# EasyEDA Pro project pcb.eprj, schematic SCHEME

## Sheets
1 KEYPAD: Board Name: BOARD; Create Date: 2025-03-02; Page Name: KEYPAD; Project Name: pcb; Schematic Name: SCHEME; Update Date: 2025-05-31; Company: EasyEDA.com; Page Size: A4; Version: V1.0
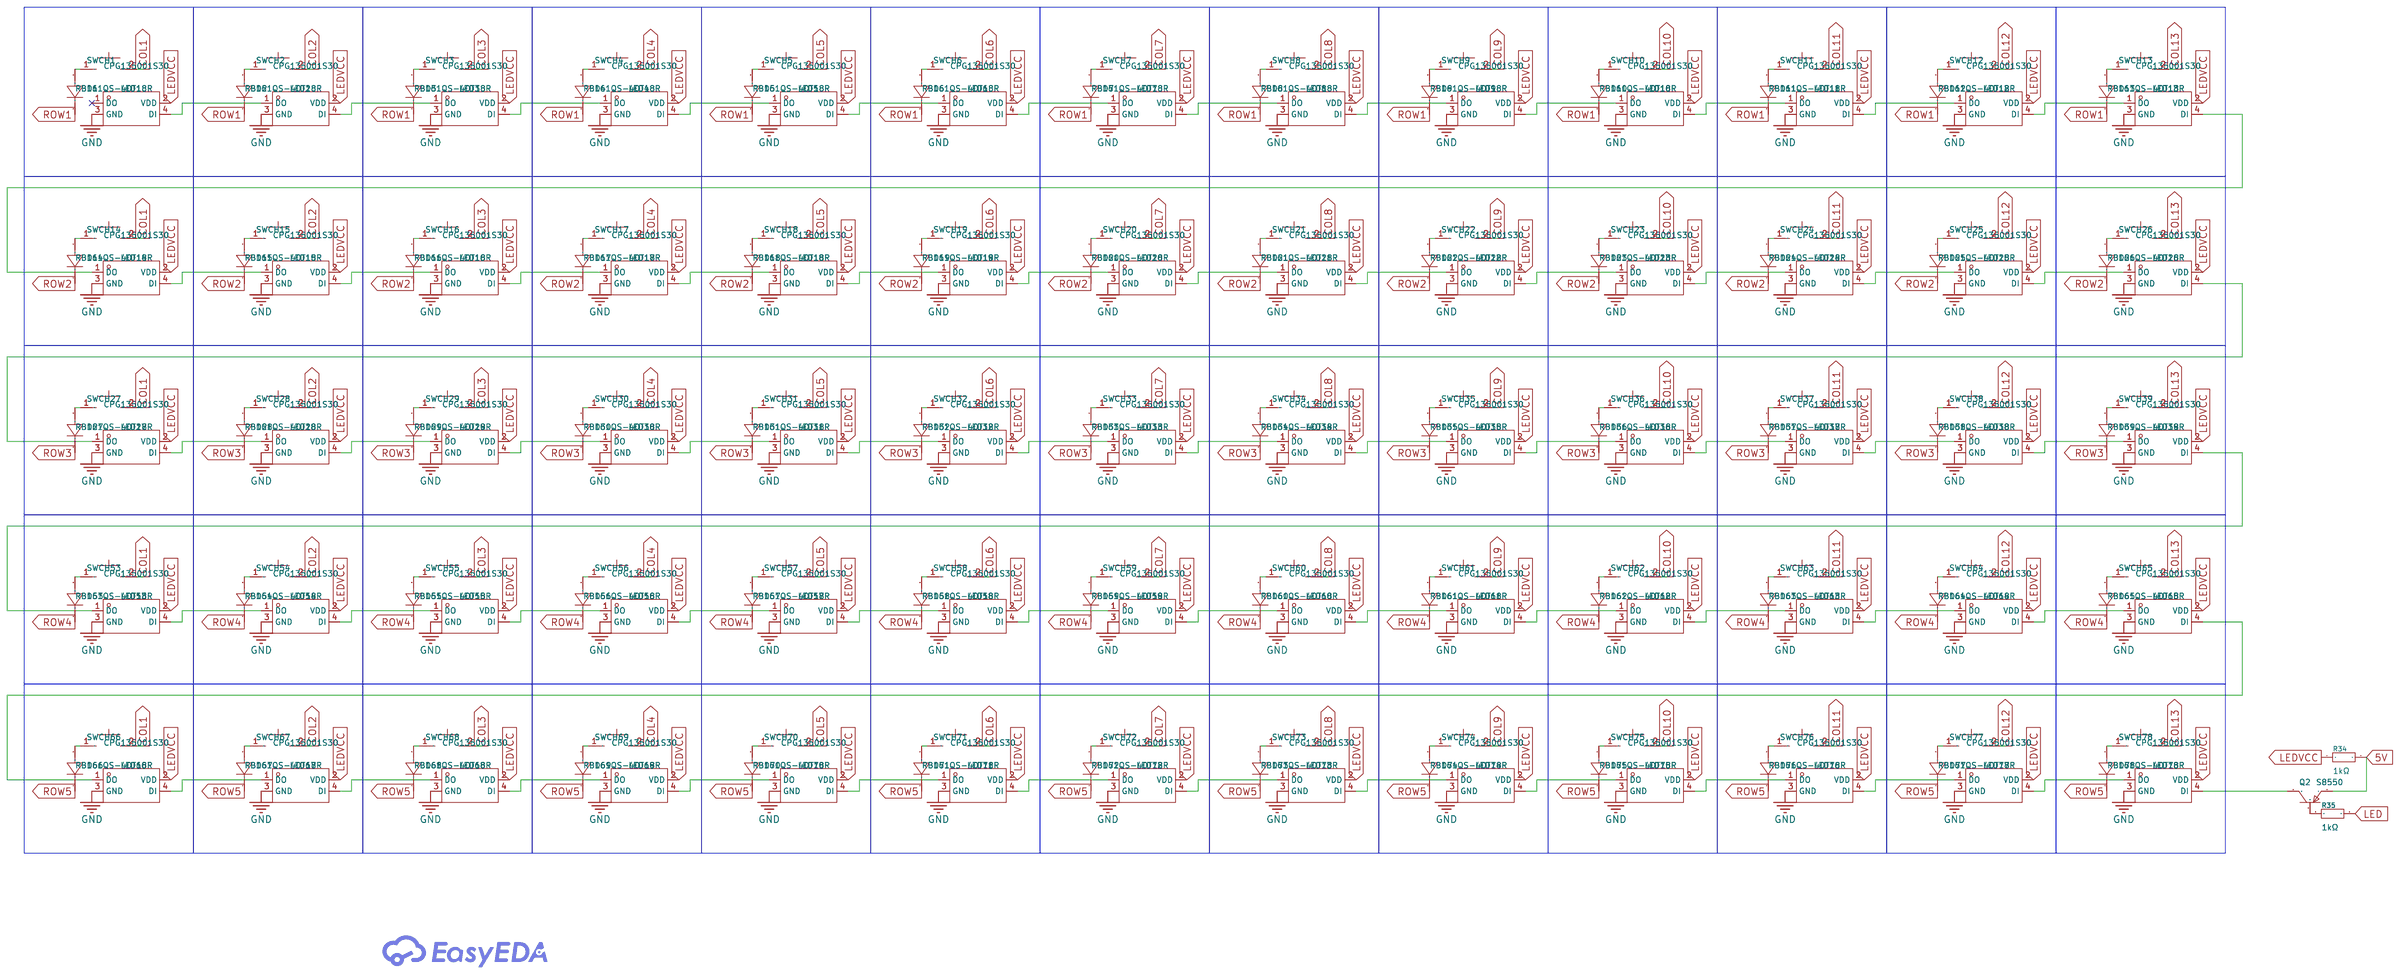
[diagram p0: KEYPAD]
2 MCU: Page Name: MCU; Update Date: 2025-06-02
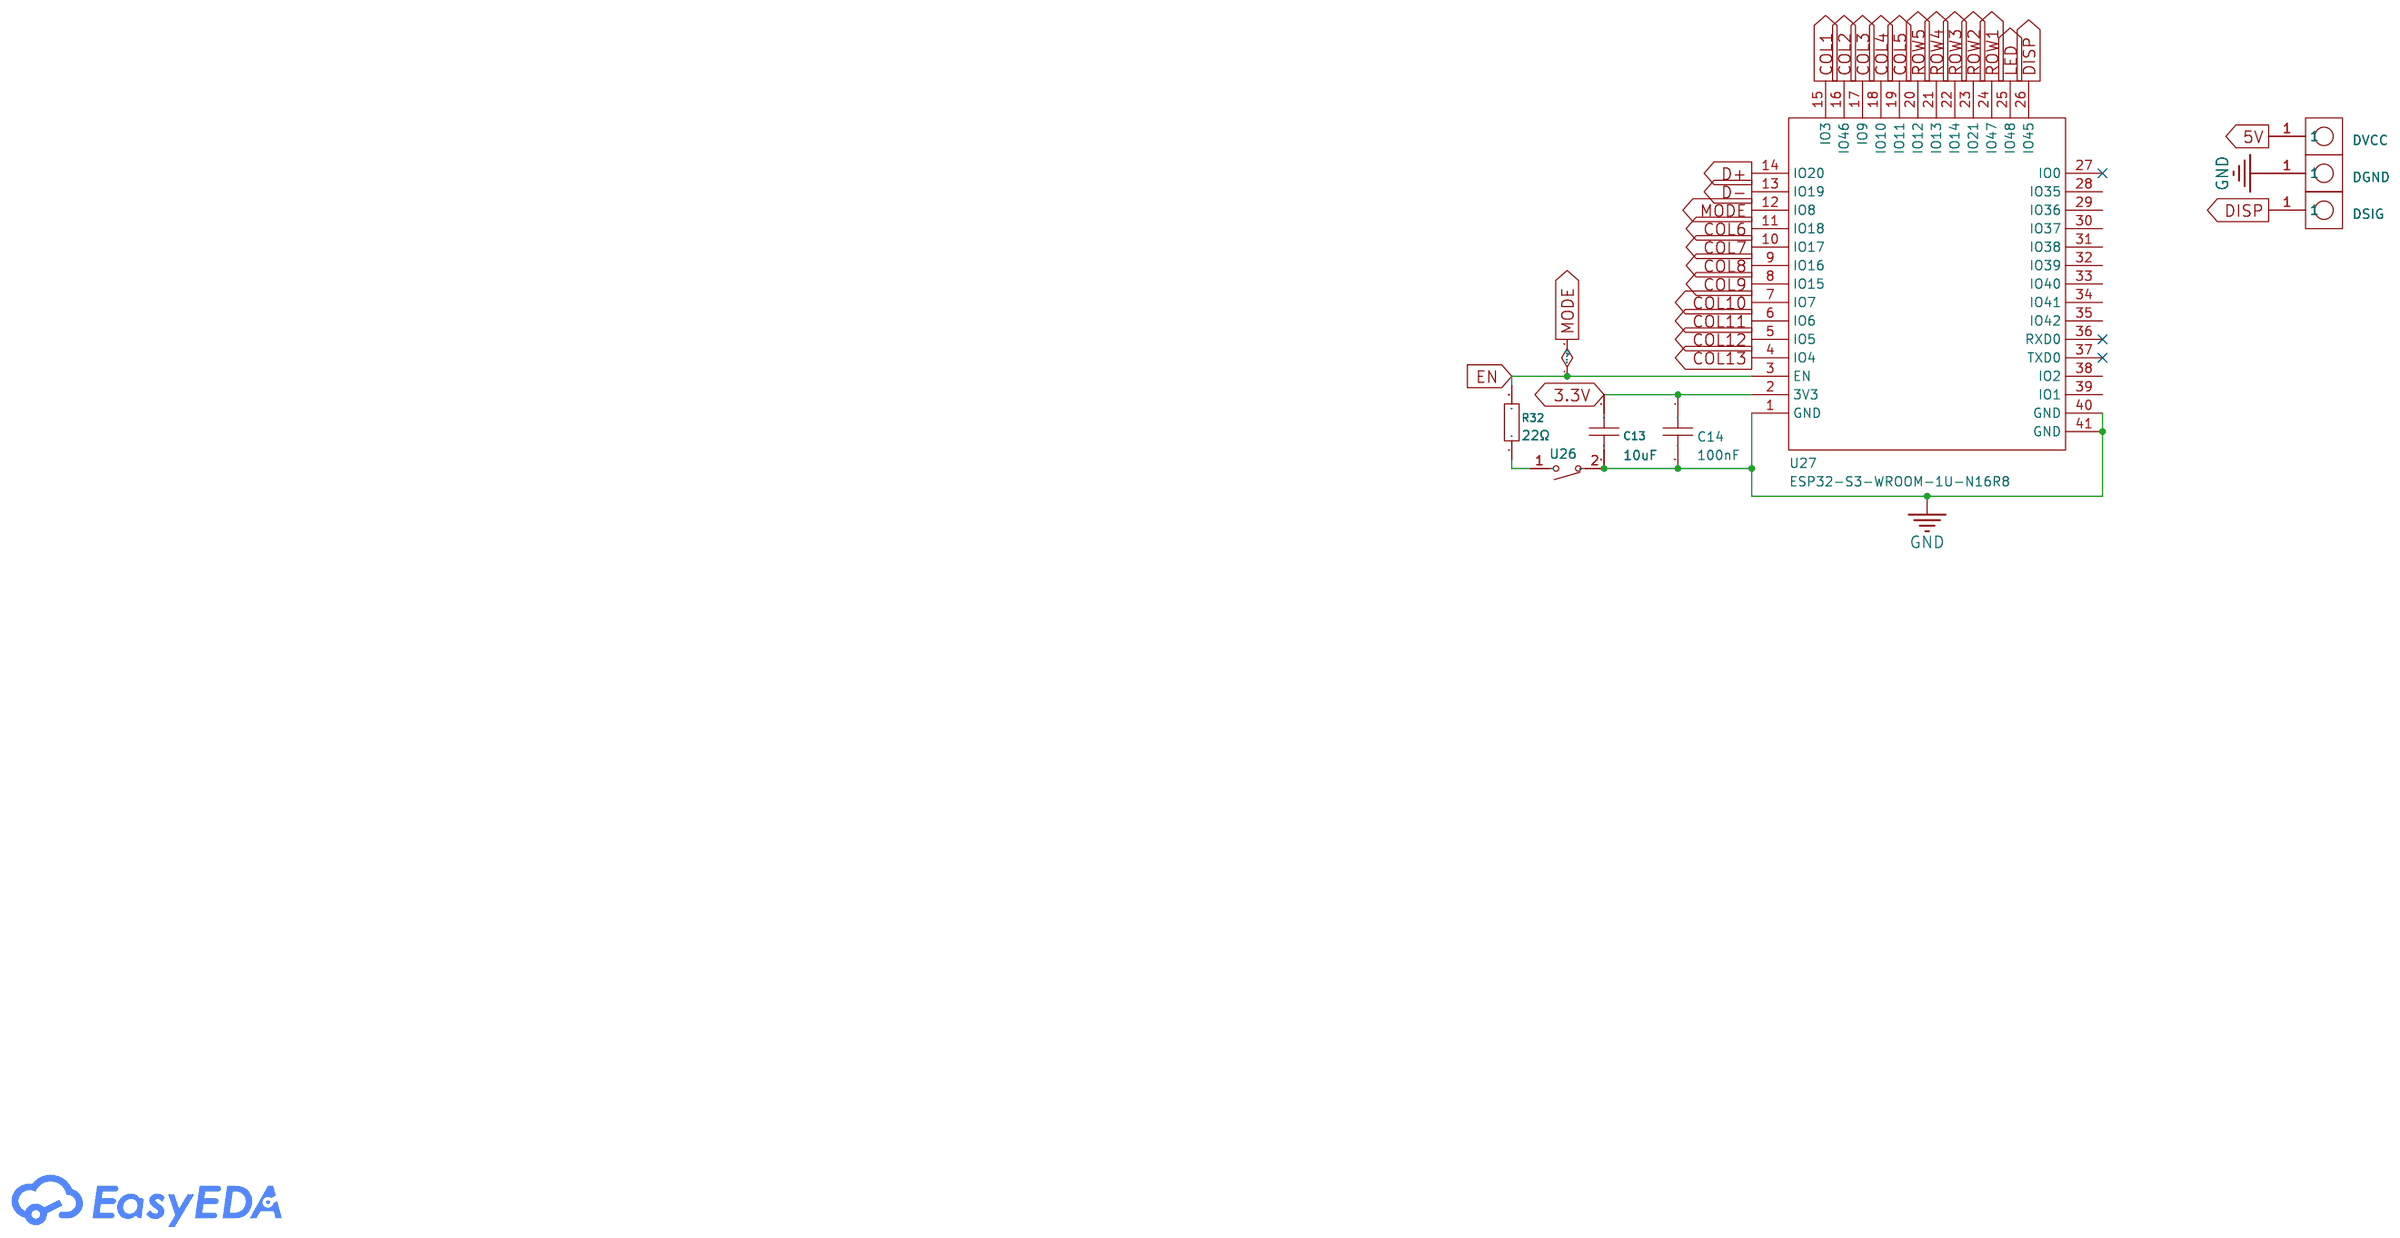
[diagram p1: MCU]
3 POWER: Create Date: 2025-03-04; Page Name: POWER; Update Date: 2025-03-05
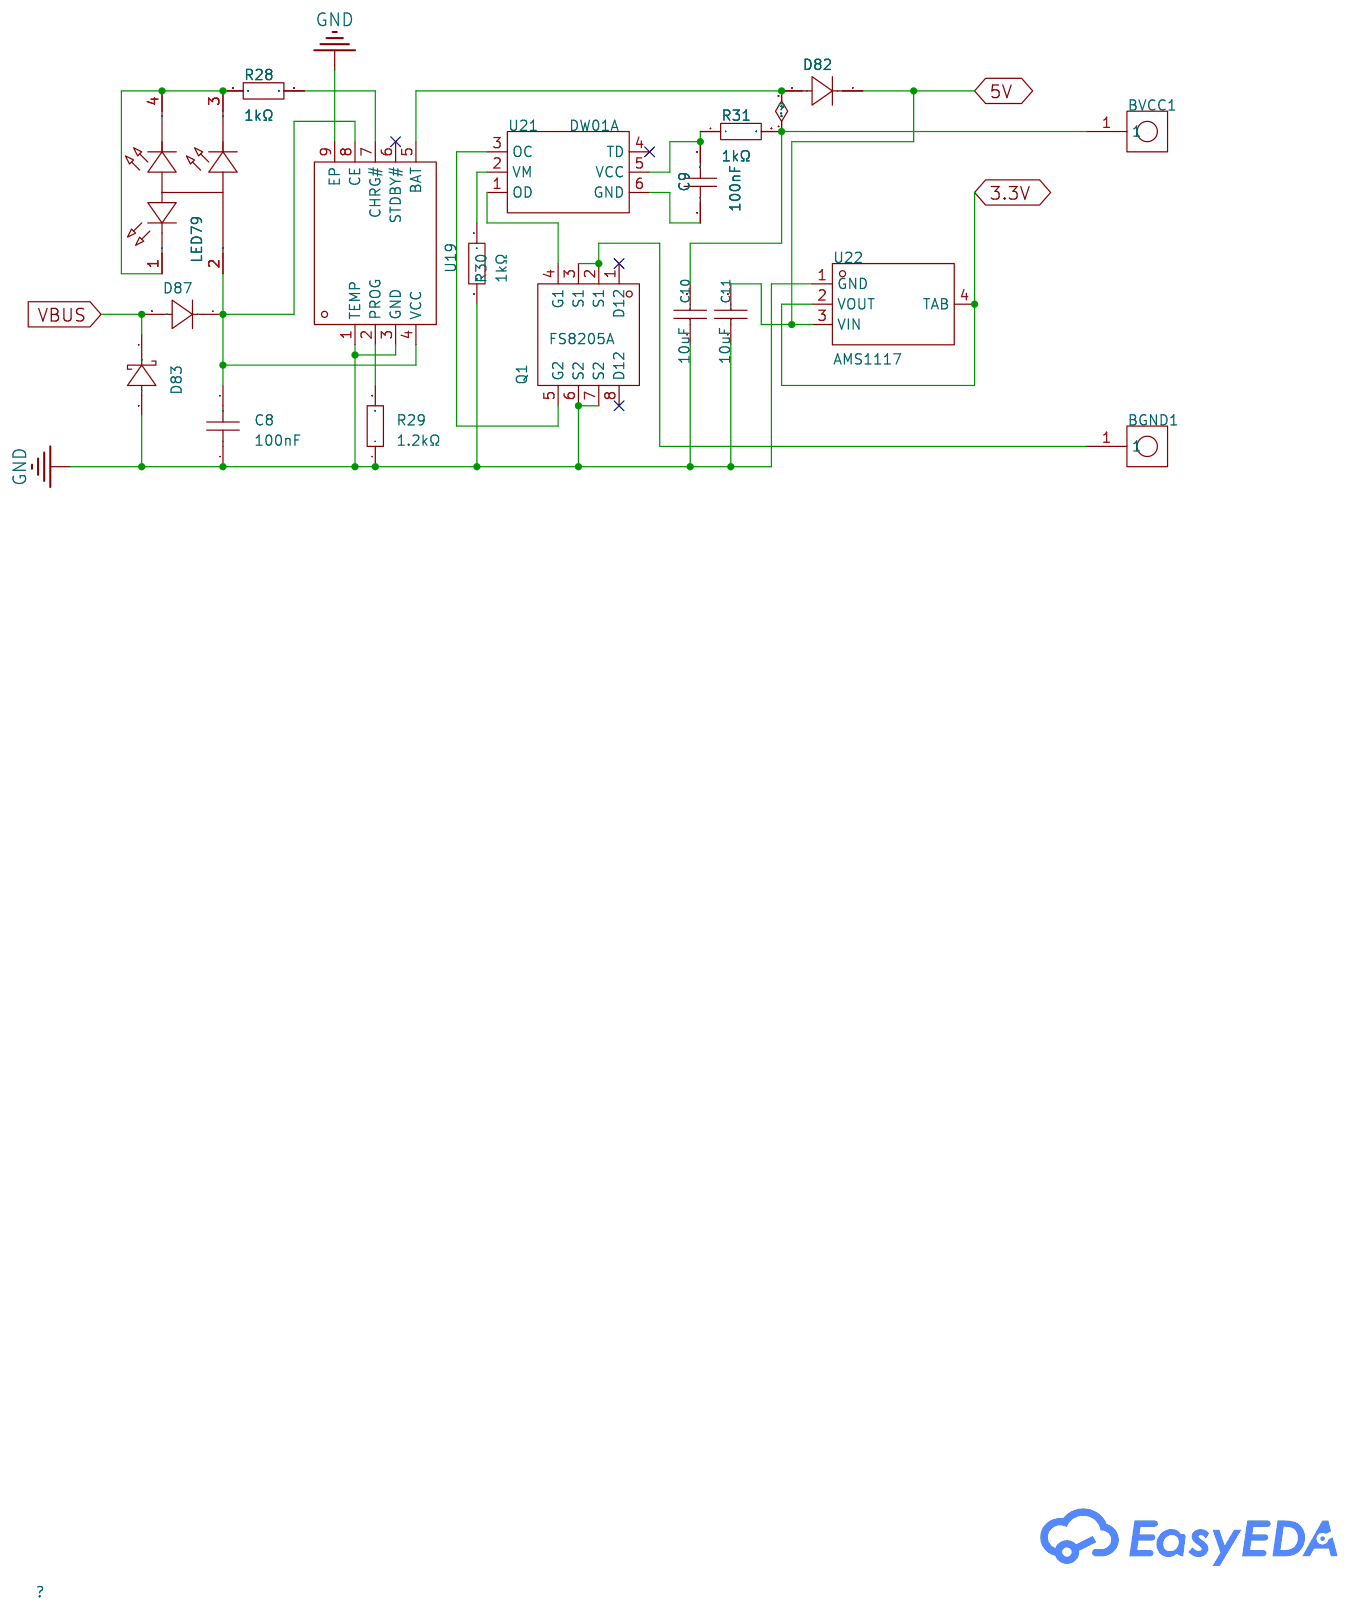
[diagram p2: POWER]
4 MODE: Create Date: 2025-03-04; Page Name: MODE; Update Date: 2025-03-06
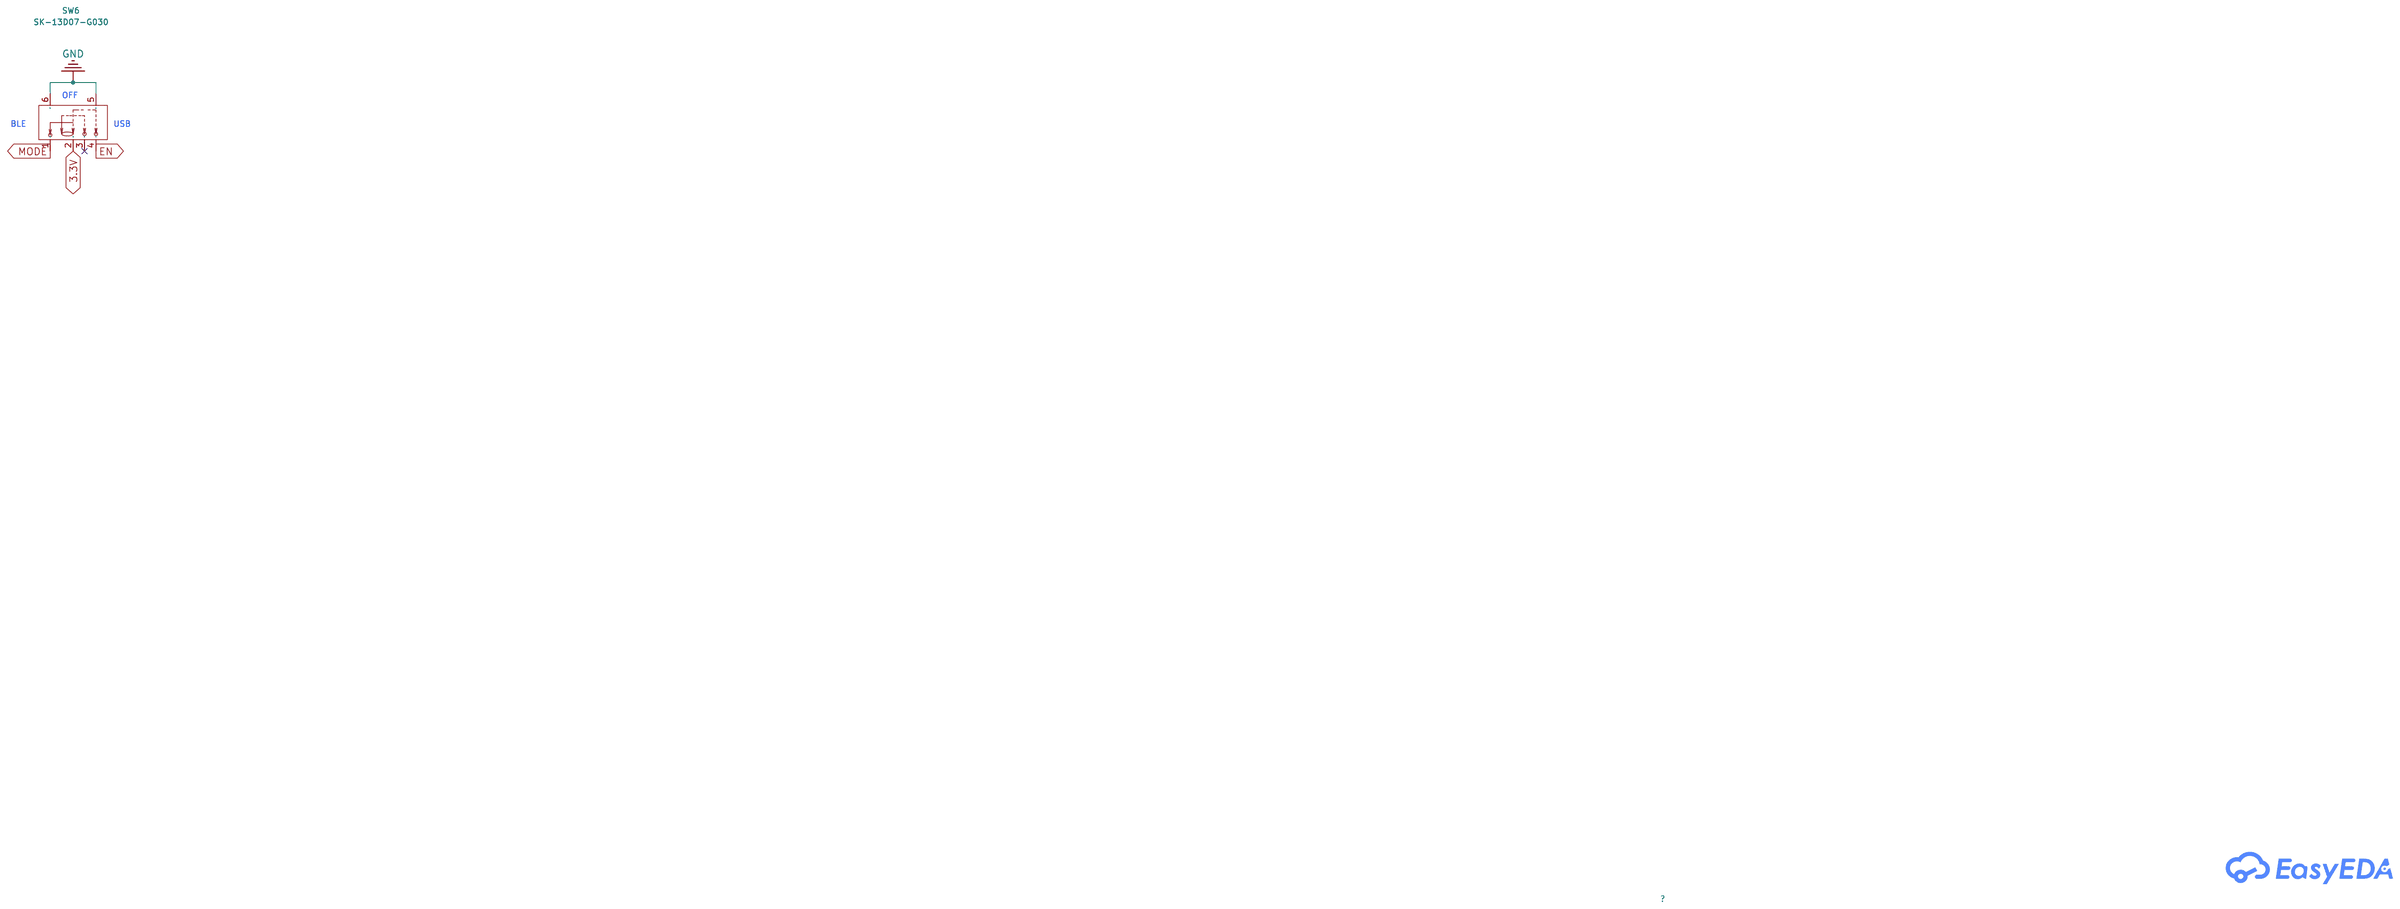
[diagram p3: MODE]
5 USB: Create Date: 2025-03-05; Page Name: USB; Update Date: 2025-03-05
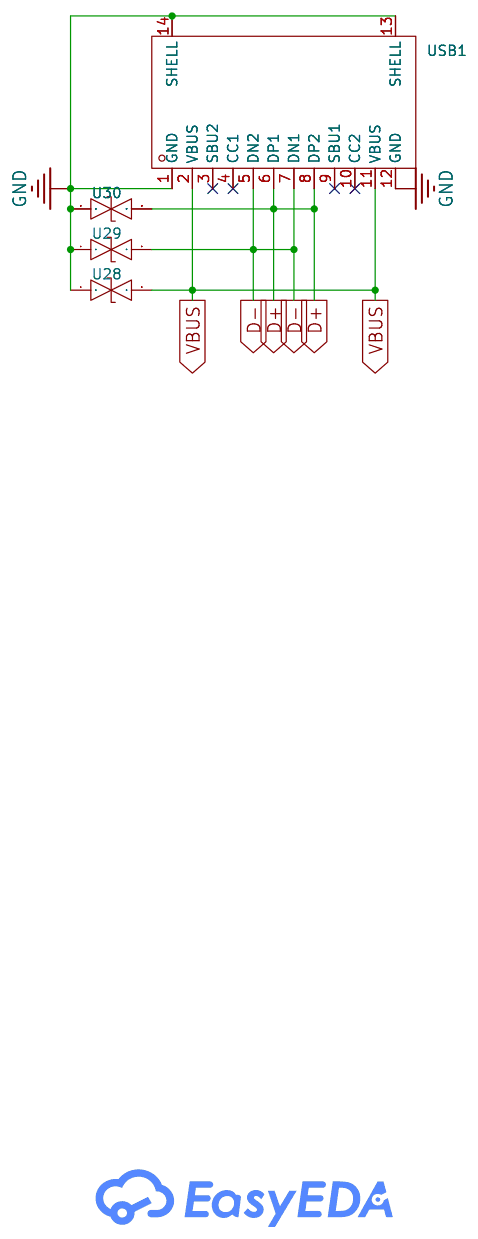
[diagram p4: USB]

## Parts
sheet KEYPAD
D1  RB161QS-40T18R  [X2-DFN1006-2_L1.0-W0.6-P0.65-RD]
D2  RB161QS-40T18R  [X2-DFN1006-2_L1.0-W0.6-P0.65-RD]
D3  RB161QS-40T18R  [X2-DFN1006-2_L1.0-W0.6-P0.65-RD]
D4  RB161QS-40T18R  [X2-DFN1006-2_L1.0-W0.6-P0.65-RD]
D5  RB161QS-40T18R  [X2-DFN1006-2_L1.0-W0.6-P0.65-RD]
D6  RB161QS-40T18R  [X2-DFN1006-2_L1.0-W0.6-P0.65-RD]
D7  RB161QS-40T18R  [X2-DFN1006-2_L1.0-W0.6-P0.65-RD]
D8  RB161QS-40T18R  [X2-DFN1006-2_L1.0-W0.6-P0.65-RD]
D9  RB161QS-40T18R  [X2-DFN1006-2_L1.0-W0.6-P0.65-RD]
D10  RB161QS-40T18R  [X2-DFN1006-2_L1.0-W0.6-P0.65-RD]
D11  RB161QS-40T18R  [X2-DFN1006-2_L1.0-W0.6-P0.65-RD]
D12  RB161QS-40T18R  [X2-DFN1006-2_L1.0-W0.6-P0.65-RD]
D13  RB161QS-40T18R  [X2-DFN1006-2_L1.0-W0.6-P0.65-RD]
D14  RB161QS-40T18R  [X2-DFN1006-2_L1.0-W0.6-P0.65-RD]
D15  RB161QS-40T18R  [X2-DFN1006-2_L1.0-W0.6-P0.65-RD]
D16  RB161QS-40T18R  [X2-DFN1006-2_L1.0-W0.6-P0.65-RD]
D17  RB161QS-40T18R  [X2-DFN1006-2_L1.0-W0.6-P0.65-RD]
D18  RB161QS-40T18R  [X2-DFN1006-2_L1.0-W0.6-P0.65-RD]
D19  RB161QS-40T18R  [X2-DFN1006-2_L1.0-W0.6-P0.65-RD]
D20  RB161QS-40T18R  [X2-DFN1006-2_L1.0-W0.6-P0.65-RD]
D21  RB161QS-40T18R  [X2-DFN1006-2_L1.0-W0.6-P0.65-RD]
D22  RB161QS-40T18R  [X2-DFN1006-2_L1.0-W0.6-P0.65-RD]
D23  RB161QS-40T18R  [X2-DFN1006-2_L1.0-W0.6-P0.65-RD]
D24  RB161QS-40T18R  [X2-DFN1006-2_L1.0-W0.6-P0.65-RD]
D25  RB161QS-40T18R  [X2-DFN1006-2_L1.0-W0.6-P0.65-RD]
D26  RB161QS-40T18R  [X2-DFN1006-2_L1.0-W0.6-P0.65-RD]
D27  RB161QS-40T18R  [X2-DFN1006-2_L1.0-W0.6-P0.65-RD]
D28  RB161QS-40T18R  [X2-DFN1006-2_L1.0-W0.6-P0.65-RD]
D29  RB161QS-40T18R  [X2-DFN1006-2_L1.0-W0.6-P0.65-RD]
D30  RB161QS-40T18R  [X2-DFN1006-2_L1.0-W0.6-P0.65-RD]
D31  RB161QS-40T18R  [X2-DFN1006-2_L1.0-W0.6-P0.65-RD]
D32  RB161QS-40T18R  [X2-DFN1006-2_L1.0-W0.6-P0.65-RD]
D33  RB161QS-40T18R  [X2-DFN1006-2_L1.0-W0.6-P0.65-RD]
D34  RB161QS-40T18R  [X2-DFN1006-2_L1.0-W0.6-P0.65-RD]
D35  RB161QS-40T18R  [X2-DFN1006-2_L1.0-W0.6-P0.65-RD]
D36  RB161QS-40T18R  [X2-DFN1006-2_L1.0-W0.6-P0.65-RD]
D37  RB161QS-40T18R  [X2-DFN1006-2_L1.0-W0.6-P0.65-RD]
D38  RB161QS-40T18R  [X2-DFN1006-2_L1.0-W0.6-P0.65-RD]
D39  RB161QS-40T18R  [X2-DFN1006-2_L1.0-W0.6-P0.65-RD]
D53  RB161QS-40T18R  [X2-DFN1006-2_L1.0-W0.6-P0.65-RD]
D54  RB161QS-40T18R  [X2-DFN1006-2_L1.0-W0.6-P0.65-RD]
D55  RB161QS-40T18R  [X2-DFN1006-2_L1.0-W0.6-P0.65-RD]
D56  RB161QS-40T18R  [X2-DFN1006-2_L1.0-W0.6-P0.65-RD]
D57  RB161QS-40T18R  [X2-DFN1006-2_L1.0-W0.6-P0.65-RD]
D58  RB161QS-40T18R  [X2-DFN1006-2_L1.0-W0.6-P0.65-RD]
D59  RB161QS-40T18R  [X2-DFN1006-2_L1.0-W0.6-P0.65-RD]
D60  RB161QS-40T18R  [X2-DFN1006-2_L1.0-W0.6-P0.65-RD]
D61  RB161QS-40T18R  [X2-DFN1006-2_L1.0-W0.6-P0.65-RD]
D62  RB161QS-40T18R  [X2-DFN1006-2_L1.0-W0.6-P0.65-RD]
D63  RB161QS-40T18R  [X2-DFN1006-2_L1.0-W0.6-P0.65-RD]
D64  RB161QS-40T18R  [X2-DFN1006-2_L1.0-W0.6-P0.65-RD]
D65  RB161QS-40T18R  [X2-DFN1006-2_L1.0-W0.6-P0.65-RD]
D66  RB161QS-40T18R  [X2-DFN1006-2_L1.0-W0.6-P0.65-RD]
D67  RB161QS-40T18R  [X2-DFN1006-2_L1.0-W0.6-P0.65-RD]
D68  RB161QS-40T18R  [X2-DFN1006-2_L1.0-W0.6-P0.65-RD]
D69  RB161QS-40T18R  [X2-DFN1006-2_L1.0-W0.6-P0.65-RD]
D70  RB161QS-40T18R  [X2-DFN1006-2_L1.0-W0.6-P0.65-RD]
D71  RB161QS-40T18R  [X2-DFN1006-2_L1.0-W0.6-P0.65-RD]
D72  RB161QS-40T18R  [X2-DFN1006-2_L1.0-W0.6-P0.65-RD]
D73  RB161QS-40T18R  [X2-DFN1006-2_L1.0-W0.6-P0.65-RD]
D74  RB161QS-40T18R  [X2-DFN1006-2_L1.0-W0.6-P0.65-RD]
D75  RB161QS-40T18R  [X2-DFN1006-2_L1.0-W0.6-P0.65-RD]
D76  RB161QS-40T18R  [X2-DFN1006-2_L1.0-W0.6-P0.65-RD]
D77  RB161QS-40T18R  [X2-DFN1006-2_L1.0-W0.6-P0.65-RD]
D78  RB161QS-40T18R  [X2-DFN1006-2_L1.0-W0.6-P0.65-RD]
LED1  XL-1010RGBC-WS2812B  [LED-SMD_4P-L1.0-W1.0-TL_XL-1010RGBC-WS2812B]
LED2  XL-1010RGBC-WS2812B  [LED-SMD_4P-L1.0-W1.0-TL_XL-1010RGBC-WS2812B]
LED3  XL-1010RGBC-WS2812B  [LED-SMD_4P-L1.0-W1.0-TL_XL-1010RGBC-WS2812B]
LED4  XL-1010RGBC-WS2812B  [LED-SMD_4P-L1.0-W1.0-TL_XL-1010RGBC-WS2812B]
LED5  XL-1010RGBC-WS2812B  [LED-SMD_4P-L1.0-W1.0-TL_XL-1010RGBC-WS2812B]
LED6  XL-1010RGBC-WS2812B  [LED-SMD_4P-L1.0-W1.0-TL_XL-1010RGBC-WS2812B]
LED7  XL-1010RGBC-WS2812B  [LED-SMD_4P-L1.0-W1.0-TL_XL-1010RGBC-WS2812B]
LED8  XL-1010RGBC-WS2812B  [LED-SMD_4P-L1.0-W1.0-TL_XL-1010RGBC-WS2812B]
LED9  XL-1010RGBC-WS2812B  [LED-SMD_4P-L1.0-W1.0-TL_XL-1010RGBC-WS2812B]
LED10  XL-1010RGBC-WS2812B  [LED-SMD_4P-L1.0-W1.0-TL_XL-1010RGBC-WS2812B]
LED11  XL-1010RGBC-WS2812B  [LED-SMD_4P-L1.0-W1.0-TL_XL-1010RGBC-WS2812B]
LED12  XL-1010RGBC-WS2812B  [LED-SMD_4P-L1.0-W1.0-TL_XL-1010RGBC-WS2812B]
LED13  XL-1010RGBC-WS2812B  [LED-SMD_4P-L1.0-W1.0-TL_XL-1010RGBC-WS2812B]
LED14  XL-1010RGBC-WS2812B  [LED-SMD_4P-L1.0-W1.0-TL_XL-1010RGBC-WS2812B]
LED15  XL-1010RGBC-WS2812B  [LED-SMD_4P-L1.0-W1.0-TL_XL-1010RGBC-WS2812B]
LED16  XL-1010RGBC-WS2812B  [LED-SMD_4P-L1.0-W1.0-TL_XL-1010RGBC-WS2812B]
LED17  XL-1010RGBC-WS2812B  [LED-SMD_4P-L1.0-W1.0-TL_XL-1010RGBC-WS2812B]
LED18  XL-1010RGBC-WS2812B  [LED-SMD_4P-L1.0-W1.0-TL_XL-1010RGBC-WS2812B]
LED19  XL-1010RGBC-WS2812B  [LED-SMD_4P-L1.0-W1.0-TL_XL-1010RGBC-WS2812B]
LED20  XL-1010RGBC-WS2812B  [LED-SMD_4P-L1.0-W1.0-TL_XL-1010RGBC-WS2812B]
LED21  XL-1010RGBC-WS2812B  [LED-SMD_4P-L1.0-W1.0-TL_XL-1010RGBC-WS2812B]
LED22  XL-1010RGBC-WS2812B  [LED-SMD_4P-L1.0-W1.0-TL_XL-1010RGBC-WS2812B]
LED23  XL-1010RGBC-WS2812B  [LED-SMD_4P-L1.0-W1.0-TL_XL-1010RGBC-WS2812B]
LED24  XL-1010RGBC-WS2812B  [LED-SMD_4P-L1.0-W1.0-TL_XL-1010RGBC-WS2812B]
LED25  XL-1010RGBC-WS2812B  [LED-SMD_4P-L1.0-W1.0-TL_XL-1010RGBC-WS2812B]
LED26  XL-1010RGBC-WS2812B  [LED-SMD_4P-L1.0-W1.0-TL_XL-1010RGBC-WS2812B]
LED27  XL-1010RGBC-WS2812B  [LED-SMD_4P-L1.0-W1.0-TL_XL-1010RGBC-WS2812B]
LED28  XL-1010RGBC-WS2812B  [LED-SMD_4P-L1.0-W1.0-TL_XL-1010RGBC-WS2812B]
LED29  XL-1010RGBC-WS2812B  [LED-SMD_4P-L1.0-W1.0-TL_XL-1010RGBC-WS2812B]
LED30  XL-1010RGBC-WS2812B  [LED-SMD_4P-L1.0-W1.0-TL_XL-1010RGBC-WS2812B]
LED31  XL-1010RGBC-WS2812B  [LED-SMD_4P-L1.0-W1.0-TL_XL-1010RGBC-WS2812B]
LED32  XL-1010RGBC-WS2812B  [LED-SMD_4P-L1.0-W1.0-TL_XL-1010RGBC-WS2812B]
LED33  XL-1010RGBC-WS2812B  [LED-SMD_4P-L1.0-W1.0-TL_XL-1010RGBC-WS2812B]
LED34  XL-1010RGBC-WS2812B  [LED-SMD_4P-L1.0-W1.0-TL_XL-1010RGBC-WS2812B]
LED35  XL-1010RGBC-WS2812B  [LED-SMD_4P-L1.0-W1.0-TL_XL-1010RGBC-WS2812B]
LED36  XL-1010RGBC-WS2812B  [LED-SMD_4P-L1.0-W1.0-TL_XL-1010RGBC-WS2812B]
LED37  XL-1010RGBC-WS2812B  [LED-SMD_4P-L1.0-W1.0-TL_XL-1010RGBC-WS2812B]
LED38  XL-1010RGBC-WS2812B  [LED-SMD_4P-L1.0-W1.0-TL_XL-1010RGBC-WS2812B]
LED39  XL-1010RGBC-WS2812B  [LED-SMD_4P-L1.0-W1.0-TL_XL-1010RGBC-WS2812B]
LED53  XL-1010RGBC-WS2812B  [LED-SMD_4P-L1.0-W1.0-TL_XL-1010RGBC-WS2812B]
LED54  XL-1010RGBC-WS2812B  [LED-SMD_4P-L1.0-W1.0-TL_XL-1010RGBC-WS2812B]
LED55  XL-1010RGBC-WS2812B  [LED-SMD_4P-L1.0-W1.0-TL_XL-1010RGBC-WS2812B]
LED56  XL-1010RGBC-WS2812B  [LED-SMD_4P-L1.0-W1.0-TL_XL-1010RGBC-WS2812B]
LED57  XL-1010RGBC-WS2812B  [LED-SMD_4P-L1.0-W1.0-TL_XL-1010RGBC-WS2812B]
LED58  XL-1010RGBC-WS2812B  [LED-SMD_4P-L1.0-W1.0-TL_XL-1010RGBC-WS2812B]
LED59  XL-1010RGBC-WS2812B  [LED-SMD_4P-L1.0-W1.0-TL_XL-1010RGBC-WS2812B]
LED60  XL-1010RGBC-WS2812B  [LED-SMD_4P-L1.0-W1.0-TL_XL-1010RGBC-WS2812B]
LED61  XL-1010RGBC-WS2812B  [LED-SMD_4P-L1.0-W1.0-TL_XL-1010RGBC-WS2812B]
LED62  XL-1010RGBC-WS2812B  [LED-SMD_4P-L1.0-W1.0-TL_XL-1010RGBC-WS2812B]
LED63  XL-1010RGBC-WS2812B  [LED-SMD_4P-L1.0-W1.0-TL_XL-1010RGBC-WS2812B]
LED64  XL-1010RGBC-WS2812B  [LED-SMD_4P-L1.0-W1.0-TL_XL-1010RGBC-WS2812B]
LED65  XL-1010RGBC-WS2812B  [LED-SMD_4P-L1.0-W1.0-TL_XL-1010RGBC-WS2812B]
LED66  XL-1010RGBC-WS2812B  [LED-SMD_4P-L1.0-W1.0-TL_XL-1010RGBC-WS2812B]
LED67  XL-1010RGBC-WS2812B  [LED-SMD_4P-L1.0-W1.0-TL_XL-1010RGBC-WS2812B]
LED68  XL-1010RGBC-WS2812B  [LED-SMD_4P-L1.0-W1.0-TL_XL-1010RGBC-WS2812B]
LED69  XL-1010RGBC-WS2812B  [LED-SMD_4P-L1.0-W1.0-TL_XL-1010RGBC-WS2812B]
LED70  XL-1010RGBC-WS2812B  [LED-SMD_4P-L1.0-W1.0-TL_XL-1010RGBC-WS2812B]
LED71  XL-1010RGBC-WS2812B  [LED-SMD_4P-L1.0-W1.0-TL_XL-1010RGBC-WS2812B]
LED72  XL-1010RGBC-WS2812B  [LED-SMD_4P-L1.0-W1.0-TL_XL-1010RGBC-WS2812B]
LED73  XL-1010RGBC-WS2812B  [LED-SMD_4P-L1.0-W1.0-TL_XL-1010RGBC-WS2812B]
LED74  XL-1010RGBC-WS2812B  [LED-SMD_4P-L1.0-W1.0-TL_XL-1010RGBC-WS2812B]
LED75  XL-1010RGBC-WS2812B  [LED-SMD_4P-L1.0-W1.0-TL_XL-1010RGBC-WS2812B]
LED76  XL-1010RGBC-WS2812B  [LED-SMD_4P-L1.0-W1.0-TL_XL-1010RGBC-WS2812B]
LED77  XL-1010RGBC-WS2812B  [LED-SMD_4P-L1.0-W1.0-TL_XL-1010RGBC-WS2812B]
LED78  XL-1010RGBC-WS2812B  [LED-SMD_4P-L1.0-W1.0-TL_XL-1010RGBC-WS2812B]
Q2  S8550  [SOT-23-3_L2.9-W1.3-P1.90-LS2.4-BR]
R34  1kΩ  [R0402]
R35  1kΩ  [R0402]
SWCH1  CPG135001S30  [CONN-SMD_HOTPLUGPAKAGE__C9900010116]
SWCH2  CPG135001S30  [CONN-SMD_HOTPLUGPAKAGE__C9900010116]
SWCH3  CPG135001S30  [CONN-SMD_HOTPLUGPAKAGE__C9900010116]
SWCH4  CPG135001S30  [CONN-SMD_HOTPLUGPAKAGE__C9900010116]
SWCH5  CPG135001S30  [CONN-SMD_HOTPLUGPAKAGE__C9900010116]
SWCH6  CPG135001S30  [CONN-SMD_HOTPLUGPAKAGE__C9900010116]
SWCH7  CPG135001S30  [CONN-SMD_HOTPLUGPAKAGE__C9900010116]
SWCH8  CPG135001S30  [CONN-SMD_HOTPLUGPAKAGE__C9900010116]
SWCH9  CPG135001S30  [CONN-SMD_HOTPLUGPAKAGE__C9900010116]
SWCH10  CPG135001S30  [CONN-SMD_HOTPLUGPAKAGE__C9900010116]
SWCH11  CPG135001S30  [CONN-SMD_HOTPLUGPAKAGE__C9900010116]
SWCH12  CPG135001S30  [CONN-SMD_HOTPLUGPAKAGE__C9900010116]
SWCH13  CPG135001S30  [CONN-SMD_HOTPLUGPAKAGE__C9900010116]
SWCH14  CPG135001S30  [CONN-SMD_HOTPLUGPAKAGE__C9900010116]
SWCH15  CPG135001S30  [CONN-SMD_HOTPLUGPAKAGE__C9900010116]
SWCH16  CPG135001S30  [CONN-SMD_HOTPLUGPAKAGE__C9900010116]
SWCH17  CPG135001S30  [CONN-SMD_HOTPLUGPAKAGE__C9900010116]
SWCH18  CPG135001S30  [CONN-SMD_HOTPLUGPAKAGE__C9900010116]
SWCH19  CPG135001S30  [CONN-SMD_HOTPLUGPAKAGE__C9900010116]
SWCH20  CPG135001S30  [CONN-SMD_HOTPLUGPAKAGE__C9900010116]
SWCH21  CPG135001S30  [CONN-SMD_HOTPLUGPAKAGE__C9900010116]
SWCH22  CPG135001S30  [CONN-SMD_HOTPLUGPAKAGE__C9900010116]
SWCH23  CPG135001S30  [CONN-SMD_HOTPLUGPAKAGE__C9900010116]
SWCH24  CPG135001S30  [CONN-SMD_HOTPLUGPAKAGE__C9900010116]
SWCH25  CPG135001S30  [CONN-SMD_HOTPLUGPAKAGE__C9900010116]
SWCH26  CPG135001S30  [CONN-SMD_HOTPLUGPAKAGE__C9900010116]
SWCH27  CPG135001S30  [CONN-SMD_HOTPLUGPAKAGE__C9900010116]
SWCH28  CPG135001S30  [CONN-SMD_HOTPLUGPAKAGE__C9900010116]
SWCH29  CPG135001S30  [CONN-SMD_HOTPLUGPAKAGE__C9900010116]
SWCH30  CPG135001S30  [CONN-SMD_HOTPLUGPAKAGE__C9900010116]
SWCH31  CPG135001S30  [CONN-SMD_HOTPLUGPAKAGE__C9900010116]
SWCH32  CPG135001S30  [CONN-SMD_HOTPLUGPAKAGE__C9900010116]
SWCH33  CPG135001S30  [CONN-SMD_HOTPLUGPAKAGE__C9900010116]
SWCH34  CPG135001S30  [CONN-SMD_HOTPLUGPAKAGE__C9900010116]
SWCH35  CPG135001S30  [CONN-SMD_HOTPLUGPAKAGE__C9900010116]
SWCH36  CPG135001S30  [CONN-SMD_HOTPLUGPAKAGE__C9900010116]
SWCH37  CPG135001S30  [CONN-SMD_HOTPLUGPAKAGE__C9900010116]
SWCH38  CPG135001S30  [CONN-SMD_HOTPLUGPAKAGE__C9900010116]
SWCH39  CPG135001S30  [CONN-SMD_HOTPLUGPAKAGE__C9900010116]
SWCH53  CPG135001S30  [CONN-SMD_HOTPLUGPAKAGE__C9900010116]
SWCH54  CPG135001S30  [CONN-SMD_HOTPLUGPAKAGE__C9900010116]
SWCH55  CPG135001S30  [CONN-SMD_HOTPLUGPAKAGE__C9900010116]
SWCH56  CPG135001S30  [CONN-SMD_HOTPLUGPAKAGE__C9900010116]
SWCH57  CPG135001S30  [CONN-SMD_HOTPLUGPAKAGE__C9900010116]
SWCH58  CPG135001S30  [CONN-SMD_HOTPLUGPAKAGE__C9900010116]
SWCH59  CPG135001S30  [CONN-SMD_HOTPLUGPAKAGE__C9900010116]
SWCH60  CPG135001S30  [CONN-SMD_HOTPLUGPAKAGE__C9900010116]
SWCH61  CPG135001S30  [CONN-SMD_HOTPLUGPAKAGE__C9900010116]
SWCH62  CPG135001S30  [CONN-SMD_HOTPLUGPAKAGE__C9900010116]
SWCH63  CPG135001S30  [CONN-SMD_HOTPLUGPAKAGE__C9900010116]
SWCH64  CPG135001S30  [CONN-SMD_HOTPLUGPAKAGE__C9900010116]
SWCH65  CPG135001S30  [CONN-SMD_HOTPLUGPAKAGE__C9900010116]
SWCH66  CPG135001S30  [CONN-SMD_HOTPLUGPAKAGE__C9900010116]
SWCH67  CPG135001S30  [CONN-SMD_HOTPLUGPAKAGE__C9900010116]
SWCH68  CPG135001S30  [CONN-SMD_HOTPLUGPAKAGE__C9900010116]
SWCH69  CPG135001S30  [CONN-SMD_HOTPLUGPAKAGE__C9900010116]
SWCH70  CPG135001S30  [CONN-SMD_HOTPLUGPAKAGE__C9900010116]
SWCH71  CPG135001S30  [CONN-SMD_HOTPLUGPAKAGE__C9900010116]
SWCH72  CPG135001S30  [CONN-SMD_HOTPLUGPAKAGE__C9900010116]
SWCH73  CPG135001S30  [CONN-SMD_HOTPLUGPAKAGE__C9900010116]
SWCH74  CPG135001S30  [CONN-SMD_HOTPLUGPAKAGE__C9900010116]
SWCH75  CPG135001S30  [CONN-SMD_HOTPLUGPAKAGE__C9900010116]
SWCH76  CPG135001S30  [CONN-SMD_HOTPLUGPAKAGE__C9900010116]
SWCH77  CPG135001S30  [CONN-SMD_HOTPLUGPAKAGE__C9900010116]
SWCH78  CPG135001S30  [CONN-SMD_HOTPLUGPAKAGE__C9900010116]
sheet MCU
C13  10uF  [C0603]
C14  100nF  [C0402]
DGND  -  [PADX1X]
DSIG  -  [PADX1X]
DVCC  -  [PADX1X]
R32  22Ω  [R0402]
U26  TS2306A 200gf 002  [SW-SMD_L3.0-W2.0-LS3.5]
U27  ESP32-S3-WROOM-1U-N16R8  [WIRELM-SMD_ESP32-S3-WROOM-1U]
sheet MODE
SW6  SK-13D07-G030  [SW-TH_DEALON_SK-13D07-G3]
sheet POWER
BGND1  -  [PADX1X]
BVCC1  -  [PADX1X]
C8  100nF  [C0402]
C9  100nF  [C0402]
C10  10uF  [C0402]
C11  10uF  [C0402]
D82  1N4007 A7  [SOD-123FL_L2.8-W1.8-LS3.7-RD]
D83  BAT760-7  [SOD-323_L1.7-W1.3-LS2.6-RD]
D87  1N4007 A7  [SOD-123FL_L2.8-W1.8-LS3.7-RD]
LED79  XL-1615RGBC-RF  [LED-ARRAY-SMD_4P-L1.6-W1.5-BR_XL-1615RGBC-RF]
Q1  FS8205A  [TSSOP-8_L4.4-W3.0-P0.65-LS6.4-BL-2]
R28  1kΩ  [R0603]
R29  1.2kΩ  [R0402]
R30  1kΩ  [R0603]
R31  1kΩ  [R0603]
U19  TP4056  [ESOP-8_L4.9-W3.9-P1.27-LS6.0-BL-EP]
U21  DW01A  [SOT-23-6_L2.9-W1.6-P0.95-LS2.8-BL]
U22  AMS1117  [SOT-223-3_L6.5-W3.5-P3.05-LS7.0]
sheet USB
U28  LESD5D5.0CT1G  [SOD-523_L1.2-W0.8-LS1.6-BI]
U29  LESD5D5.0CT1G  [SOD-523_L1.2-W0.8-LS1.6-BI]
U30  LESD5D5.0CT1G  [SOD-523_L1.2-W0.8-LS1.6-BI]
USB1  TYPE-C 16PIN 2MD(073)  [USB-C-SMD_TYPE-C-6PIN-2MD-073]

## Library data of the parts
D1-D39 D53-D78 = RB161QS-40T18R: Diode Configuration:Independent Type Forward Voltage (Vf@If):600mV@1A Reverse Voltage (Vr):40V Rectified Current:1A Reverse Leakage Current (Ir):100uA@10V; LCSC Part Name: 电压:40V 电流:1A; Supplier Part: C2837790; Manufacturer: ROHM(罗姆); Supplier Footprint: 0402; JLCPCB Part Class: Extended Part; Datasheet: https://atta.szlcsc.com/upload/public/pdf/source/20211010/C2837790_9DFCE7771C4E041BA4561B652FD916E7.pdf; Supplier: LCSC; Diode Configuration: Independent Type; Forward Voltage (Vf@If): 600mV@1A; Reverse Voltage (Vr): 40V; Rectified Current: 1A; Reverse Leakage Current (Ir): 100uA@10V; Check: true
LED1-LED39 LED53-LED78 = XL-1010RGBC-WS2812B: Supplier Part: C5349953; Manufacturer: XINGLIGHT(成兴光); Supplier Footprint: SMD,1x1mm; JLCPCB Part Class: Extended Part; Datasheet: https://atta.szlcsc.com/upload/public/pdf/source/20240218/17D2BD8F4295D202E0F5662BF6E5539A.pdf; Supplier: LCSC
Q2 = S8550_C5249675: Supplier Part: C5249675; Manufacturer: ElecSuper(静芯微); Supplier Footprint: SOT-23; JLCPCB Part Class: Extended Part; Datasheet: https://atta.szlcsc.com/upload/public/pdf/source/20221109/3B2F876C24DC917977FF2768185D7095.pdf; Supplier: LCSC; type: PNP; Pd - Power Dissipation: 300mW; DC Current Gain: 120; Transition frequency(fT): 150MHz; Current - Collector Cutoff: 100nA; Vce Saturation(VCE(sat)): 600mV
R34 R35 = 0402WGF1001TCE: LCSC Part Name: 1kΩ ±1% 62.5mW 厚膜电阻; Supplier Part: C11702; Manufacturer: UNI-ROYAL(厚声); Supplier Footprint: 0402; JLCPCB Part Class: Basic Part; Datasheet: https://atta.szlcsc.com/upload/public/pdf/source/20200306/C422600_1E6D84923E4A46A82E41ADD87F860B5C.pdf; Supplier: LCSC; Type: Thick Film Resistors; Tolerance: ±1%; Temperature Coefficient: ±100ppm/℃; Operating Temperature Range: -55℃~+155℃
SWCH1-SWCH39 SWCH53-SWCH78 = CPG135001S30: Supplier Part: C5333465; Manufacturer: Kailh(凯华); Supplier Footprint: SMD; JLCPCB Part Class: Extended Part; Datasheet: https://atta.szlcsc.com/upload/public/pdf/source/20230221/F2596BFC1F80598C5A1E4E2C86A4AB5C.pdf; Supplier: LCSC
C13 = CL10A106KP8NNNC: LCSC Part Name: 10uF ±10% 10V; Supplier Part: C19702; Manufacturer: SAMSUNG(三星); Supplier Footprint: 0603; JLCPCB Part Class: Basic Part; Datasheet: https://atta.szlcsc.com/upload/public/pdf/source/20160218/1457707763339.pdf; Supplier: LCSC; Tolerance: ±10%; Check: true
C8 C9 C14 = GMC04X7R104K10NT: LCSC Part Name: 100nF ±10% 10V; Supplier Part: C3846972; Manufacturer: CAL-CHIP; Supplier Footprint: 0402; JLCPCB Part Class: Extended Part; Supplier: LCSC; Tolerance: ±10%; Check: true
BGND1 BVCC1 DGND DSIG DVCC = PADX1X
R32 = 0402WGF220JTCE: LCSC Part Name: 22Ω ±1% 62.5mW 厚膜电阻; Supplier Part: C25092; Manufacturer: UNI-ROYAL(厚声); Supplier Footprint: 0402; JLCPCB Part Class: Basic Part; Datasheet: https://atta.szlcsc.com/upload/public/pdf/source/20200306/C422600_1E6D84923E4A46A82E41ADD87F860B5C.pdf; Supplier: LCSC; Type: Thick Film Resistors; Tolerance: ±1%; Temperature Coefficient: ±100ppm/℃; Operating Temperature Range: -55℃~+155℃; Check: true
U26 = TS2306A 200gf 002: LCSC Part Name: 薄膜开关 2*3*0.6mm 蓝牙耳机/开机按键 两脚 黄膜黑点 200gf; Supplier Part: C5363482; Manufacturer: SHOU HAN(首韩); Supplier Footprint: SMD; JLCPCB Part Class: Extended Part; Datasheet: https://atta.szlcsc.com/upload/public/pdf/source/20230321/144662D432400ADC228EB2A996730BBD.pdf; Supplier: LCSC; Circuit: SPST; Actuator Style: Round Button; Operating Force: 200gf; Mounting Style: Brick nogging; Switch Length: 3mm; Switch Width: 2mm; Switch Height: 0.6mm; Strike Gundam: 不带; Contact Current: 50mA; Voltage Rating (DC): 5V; Power Rating: 0.25W; Insulation Resistance: 100MΩ; Actuator/Cap Color: Yellow; With Lamp: No; Mechanical Life: 30万次; Operating Temperature: -40℃~+80℃; Check: true
U27 = ESP32-S3-WROOM-1U-N16R8: Supplier Part: C3013946; Manufacturer: ESPRESSIF(乐鑫); Supplier Footprint: SMD,18x19.2mm; JLCPCB Part Class: Extended Part; Datasheet: https://atta.szlcsc.com/upload/public/pdf/source/20240130/9D71F4DF55874C504AB629FEEE3F038E.pdf; Supplier: LCSC; Check: true
SW6 = SK-13D07-G030: LCSC Part Name: 横柄拨动开关; Supplier Part: C2896621; Manufacturer: G-Switch(品赞); Supplier Footprint: 插件; JLCPCB Part Class: Extended Part; Datasheet: https://atta.szlcsc.com/upload/public/pdf/source/20221227/592A2867BF26BF5E9C57CC68846136A9.pdf; Supplier: LCSC; Actuator Color: Black; Current Rating (DC): 0.5A; Voltage Rating (DC): 250V
C10 C11 = CL05A106MQ5NUNC: LCSC Part Name: 10uF ±20% 6.3V; Supplier Part: C15525; Manufacturer: SAMSUNG(三星); Supplier Footprint: 0402; JLCPCB Part Class: Basic Part; Datasheet: https://atta.szlcsc.com/upload/public/pdf/source/20220823/2B02EE04F8F211D38A52DCB16EB6BEBA.pdf; Supplier: LCSC; Tolerance: ±20%; Check: true
D82 D87 = 1N4007 A7: LCSC Part Name: 电压:1kV 电流:1A; Supplier Part: C2902912; Manufacturer: MSKSEMI(美森科); Supplier Footprint: SOD-123FL; JLCPCB Part Class: Extended Part; Datasheet: https://atta.szlcsc.com/upload/public/pdf/source/20240508/1829C9D8507EFBB572682FFAB90585C9.pdf; Supplier: LCSC; Forward Voltage (Vf@If): 1V@1A; Reverse Leakage Current: 10uA@1kV; Check: true
D83 = BAT760-7_C27636120: Supplier Part: C27636120; Manufacturer: DOWO(东沃); Supplier Footprint: SOD-323; JLCPCB Part Class: Extended Part; Datasheet: https://atta.szlcsc.com/upload/public/pdf/source/20240708/7F0728DC5D414B449CCE26DC93A4FF4F.pdf; Supplier: LCSC; Check: true
LED79 = XL-1615RGBC-RF: Supplier Part: C965840; Manufacturer: XINGLIGHT(成兴光); Supplier Footprint: 0606; JLCPCB Part Class: Extended Part; Datasheet: https://atta.szlcsc.com/upload/public/pdf/source/20221102/F1B1FC7E45BA82C0C0D2B0679BEE9200.pdf; Supplier: LCSC; Diode Configuration: Common Anode; Viewing Angle: 120°; Lens Color: Colorless and transparent; Installation Method: Positive Stick; Operating Temperature: -30℃~+85℃; Check: true
Q1 = FS8205A_C16052: LCSC Part Name: 2个N沟道 耐压:20V 电流:6A; Supplier Part: C16052; Manufacturer: FORTUNE(富晶); Supplier Footprint: TSSOP-8; JLCPCB Part Class: Extended Part; Datasheet: https://atta.szlcsc.com/upload/public/pdf/source/20140228/1457706997167.pdf; Supplier: LCSC; Type: 2 N-Channel; Drain Source On Resistance (RDS(on)@Vgs,Id): 25mΩ@4.5V,4A; Gate Threshold Voltage (Vgs(th)@Id): 1V@250uA; Check: true
R28 R30 R31 = 0603WAF1001T5E: LCSC Part Name: 1kΩ ±1% 100mW 厚膜电阻; Supplier Part: C21190; Manufacturer: UNI-ROYAL(厚声); Supplier Footprint: 0603; JLCPCB Part Class: Basic Part; Datasheet: https://atta.szlcsc.com/upload/public/pdf/source/20200306/C422600_1E6D84923E4A46A82E41ADD87F860B5C.pdf; Supplier: LCSC; Type: Thick Film Resistors; Tolerance: ±1%; Temperature Coefficient: ±100ppm/℃; Operating Temperature Range: -55℃~+155℃; Check: true
R29 = 0402WGF1201TCE: LCSC Part Name: 1.2kΩ ±1% 62.5mW 厚膜电阻; Supplier Part: C25862; Manufacturer: UNI-ROYAL(厚声); Supplier Footprint: 0402; JLCPCB Part Class: Extended Part; Datasheet: https://atta.szlcsc.com/upload/public/pdf/source/20200306/C422600_1E6D84923E4A46A82E41ADD87F860B5C.pdf; Supplier: LCSC; Type: Thick Film Resistors; Tolerance: ±1%; Temperature Coefficient: ±100ppm/℃; Operating Temperature Range: -55℃~+155℃; Check: true
U19 = TP4056_C382139: LCSC Part Name: 1A锂电池充电IC; Supplier Part: C382139; Manufacturer: TPOWER(天源); Supplier Footprint: ESOP-8; JLCPCB Part Class: Extended Part; Datasheet: https://atta.szlcsc.com/upload/public/pdf/source/20190327/C382139_EC85960E6FE3E26856C240C81751A184.pdf; Supplier: LCSC; The Chip Type: Linear charging chip; Supply Voltage: 4V~6V; Maximum Charge Current: 1A; Charging Saturation Voltage: 4.2V; Type of Battery: Lithium-ion/Polymer; Number of Cells: 1; Operating Temperature: -40℃~+85℃; Check: true
U21 = DW01A_C351410: Supplier Part: C351410; Manufacturer: PUOLOP(迪浦); Supplier Footprint: SOT-23-6L; JLCPCB Part Class: Extended Part; Datasheet: https://atta.szlcsc.com/upload/public/pdf/source/20190109/C351410_3E9B9491D1909DF24C48D1B9CD871392.pdf; Supplier: LCSC; Check: true
U22 = AMS1117-3.3_C5250992: LCSC Part Name: AMS1117-3.3; Supplier Part: C5250992; Manufacturer: TWGMC(台湾迪嘉); Supplier Footprint: SOT-223-3L; JLCPCB Part Class: Extended Part; Datasheet: https://atta.szlcsc.com/upload/public/pdf/source/20221109/A58A92B07670E85D28928AE371260E8D.pdf; Supplier: LCSC; Output Type: Fixed; Maximum Input Voltage: 12V; Output Voltage: 3.3V; Output Current: 1A; Power Supply Rejection Ratio (PSRR): 70dB@(120Hz); Operating Temperature: -40℃~+125℃@(Tj); Output Polarity: Positive electrode; Number of Outputs: 1; Check: true
U28-U30 = LESD5D5.0CT1G_C5246195: Supplier Part: C5246195; Manufacturer: Leiditech(雷卯电子); Supplier Footprint: SOD-523; JLCPCB Part Class: Extended Part; Datasheet: https://atta.szlcsc.com/upload/public/pdf/source/20221108/1C42B36F7D16189BC2911DA9C8277455.pdf; Supplier: LCSC
USB1 = TYPE-C 16PIN 2MD(073): LCSC Part Name: Type-C 母 卧贴; Supplier Part: C2765186; Manufacturer: SHOU HAN(首韩); Supplier Footprint: SMD; JLCPCB Part Class: Extended Part; Datasheet: https://atta.szlcsc.com/upload/public/pdf/source/20211123/39B17C16241EAC15C5E277BDA434118E.pdf; Supplier: LCSC; Connector Type: Type-C; Standard: USB 3.1; Gender: Female; Mounting Style: Horizontal attachment; Number of Contacts: 16P; Number of Ports: 1; Current Rating - Power (Max): 5A; Operating Temperature Range: -25℃~+85℃; Rated Voltage (Max): 5V; Connect-Disconnect Life: 5000 Cuts; Core Colour: Black; Check: false

## Nets
3.3V: C13.1 C14.1 SW6.2 U22.2(VOUT) U22.4(TAB) U27.2(3V3)
5V: C11.2 D82.1(K) DVCC.1 Q2.2(E) R34.2 U22.3(VIN)
GND: C8.1 C10.1 C11.1 C13.2 C14.2 D83.2(A) DGND.1 LED1.3(GND) LED2.3(GND) LED3.3(GND) LED4.3(GND) LED5.3(GND) LED6.3(GND) LED7.3(GND) LED8.3(GND) LED9.3(GND) LED10.3(GND) LED11.3(GND) LED12.3(GND) LED13.3(GND) LED14.3(GND) LED15.3(GND) LED16.3(GND) LED17.3(GND) LED18.3(GND) LED19.3(GND) LED20.3(GND) LED21.3(GND) LED22.3(GND) LED23.3(GND) LED24.3(GND) LED25.3(GND) LED26.3(GND) LED27.3(GND) LED28.3(GND) LED29.3(GND) LED30.3(GND) LED31.3(GND) LED32.3(GND) LED33.3(GND) LED34.3(GND) LED35.3(GND) LED36.3(GND) LED37.3(GND) LED38.3(GND) LED39.3(GND) LED53.3(GND) LED54.3(GND) LED55.3(GND) LED56.3(GND) LED57.3(GND) LED58.3(GND) LED59.3(GND) LED60.3(GND) LED61.3(GND) LED62.3(GND) LED63.3(GND) LED64.3(GND) LED65.3(GND) LED66.3(GND) LED67.3(GND) LED68.3(GND) LED69.3(GND) LED70.3(GND) LED71.3(GND) LED72.3(GND) LED73.3(GND) LED74.3(GND) LED75.3(GND) LED76.3(GND) LED77.3(GND) LED78.3(GND) Q1.6(S2) Q1.7(S2) R29.1 R30.2 SW6.5 SW6.6 U19.1(TEMP) U19.3(GND) U19.9(EP) U22.1(GND) U26.2(A&apos;) U27.1(GND) U27.40(GND) U27.41(GND) U28.1 U29.1 U30.1 USB1.1(GND) USB1.12(GND) USB1.13(SHELL) USB1.14(SHELL)
VBUS: D83.1(C) D87.2(A) U28.2 USB1.2(VBUS) USB1.11(VBUS)
COL1: SWCH1.2 SWCH14.2 SWCH27.2 SWCH53.2 SWCH66.2 U27.15(IO3)
COL2: SWCH2.2 SWCH15.2 SWCH28.2 SWCH54.2 SWCH67.2 U27.16(IO46)
COL3: SWCH3.2 SWCH16.2 SWCH29.2 SWCH55.2 SWCH68.2 U27.17(IO9)
COL4: SWCH4.2 SWCH17.2 SWCH30.2 SWCH56.2 SWCH69.2 U27.18(IO10)
COL5: SWCH5.2 SWCH18.2 SWCH31.2 SWCH57.2 SWCH70.2 U27.19(IO11)
COL6: SWCH6.2 SWCH19.2 SWCH32.2 SWCH58.2 SWCH71.2 U27.11(IO18)
COL7: SWCH7.2 SWCH20.2 SWCH33.2 SWCH59.2 SWCH72.2 U27.10(IO17)
COL8: SWCH8.2 SWCH21.2 SWCH34.2 SWCH60.2 SWCH73.2 U27.9(IO16)
COL9: SWCH9.2 SWCH22.2 SWCH35.2 SWCH61.2 SWCH74.2 U27.8(IO15)
COL10: SWCH10.2 SWCH23.2 SWCH36.2 SWCH62.2 SWCH75.2 U27.7(IO7)
COL11: SWCH11.2 SWCH24.2 SWCH37.2 SWCH63.2 SWCH76.2 U27.6(IO6)
COL12: SWCH12.2 SWCH25.2 SWCH38.2 SWCH64.2 SWCH77.2 U27.5(IO5)
COL13: SWCH13.2 SWCH26.2 SWCH39.2 SWCH65.2 SWCH78.2 U27.4(IO4)
D+: U27.14(IO20) U30.2 USB1.6(DP1) USB1.8(DP2)
D-: U27.13(IO19) U29.2 USB1.5(DN2) USB1.7(DN1)
DISP: DSIG.1 U27.26(IO45)
EN: R32.2 SW6.1 SW6.4 U27.3(EN) U27.12(IO8)
LED: R35.1 U27.25(IO48)
LEDVCC: LED1.2(VDD) LED2.2(VDD) LED3.2(VDD) LED4.2(VDD) LED5.2(VDD) LED6.2(VDD) LED7.2(VDD) LED8.2(VDD) LED9.2(VDD) LED10.2(VDD) LED11.2(VDD) LED12.2(VDD) LED13.2(VDD) LED14.2(VDD) LED15.2(VDD) LED16.2(VDD) LED17.2(VDD) LED18.2(VDD) LED19.2(VDD) LED20.2(VDD) LED21.2(VDD) LED22.2(VDD) LED23.2(VDD) LED24.2(VDD) LED25.2(VDD) LED26.2(VDD) LED27.2(VDD) LED28.2(VDD) LED29.2(VDD) LED30.2(VDD) LED31.2(VDD) LED32.2(VDD) LED33.2(VDD) LED34.2(VDD) LED35.2(VDD) LED36.2(VDD) LED37.2(VDD) LED38.2(VDD) LED39.2(VDD) LED53.2(VDD) LED54.2(VDD) LED55.2(VDD) LED56.2(VDD) LED57.2(VDD) LED58.2(VDD) LED59.2(VDD) LED60.2(VDD) LED61.2(VDD) LED62.2(VDD) LED63.2(VDD) LED64.2(VDD) LED65.2(VDD) LED66.2(VDD) LED67.2(VDD) LED68.2(VDD) LED69.2(VDD) LED70.2(VDD) LED71.2(VDD) LED72.2(VDD) LED73.2(VDD) LED74.2(VDD) LED75.2(VDD) LED76.2(VDD) LED77.2(VDD) LED78.2(VDD) R34.1
ROW1: D1.1(K) D2.1(K) D3.1(K) D4.1(K) D5.1(K) D6.1(K) D7.1(K) D8.1(K) D9.1(K) D10.1(K) D11.1(K) D12.1(K) D13.1(K) U27.24(IO47)
ROW2: D14.1(K) D15.1(K) D16.1(K) D17.1(K) D18.1(K) D19.1(K) D20.1(K) D21.1(K) D22.1(K) D23.1(K) D24.1(K) D25.1(K) D26.1(K) U27.23(IO21)
ROW3: D27.1(K) D28.1(K) D29.1(K) D30.1(K) D31.1(K) D32.1(K) D33.1(K) D34.1(K) D35.1(K) D36.1(K) D37.1(K) D38.1(K) D39.1(K) U27.22(IO14)
ROW4: D53.1(K) D54.1(K) D55.1(K) D56.1(K) D57.1(K) D58.1(K) D59.1(K) D60.1(K) D61.1(K) D62.1(K) D63.1(K) D64.1(K) D65.1(K) U27.21(IO13)
ROW5: D66.1(K) D67.1(K) D68.1(K) D69.1(K) D70.1(K) D71.1(K) D72.1(K) D73.1(K) D74.1(K) D75.1(K) D76.1(K) D77.1(K) D78.1(K) U27.20(IO12)
$2N6729: LED32.4(DI) LED33.1(DO)
$2N6737: LED28.4(DI) LED29.1(DO)
$2N6747: LED30.4(DI) LED31.1(DO)
$2N6755: LED33.4(DI) LED34.1(DO)
$2N6763: LED29.4(DI) LED30.1(DO)
$2N6775: LED31.4(DI) LED32.1(DO)
$2N6779: LED34.4(DI) LED35.1(DO)
$2N6785: D35.2(A) SWCH35.1
$2N6791: LED27.4(DI) LED28.1(DO)
$2N6803: LED53.4(DI) LED54.1(DO)
$2N6811: LED54.4(DI) LED55.1(DO)
$2N6815: D54.2(A) SWCH54.1
$2N6819: LED56.4(DI) LED57.1(DO)
$2N6827: LED57.4(DI) LED58.1(DO)
$2N6833: D57.2(A) SWCH57.1
$2N6835: D56.2(A) SWCH56.1
$2N6841: D55.2(A) SWCH55.1
$2N6843: LED61.4(DI) LED62.1(DO)
$2N6853: LED60.4(DI) LED61.1(DO)
$2N6857: D61.2(A) SWCH61.1
$2N6865: LED58.4(DI) LED59.1(DO)
$2N6873: LED59.4(DI) LED60.1(DO)
$2N6881: D60.2(A) SWCH60.1
$2N6885: D59.2(A) SWCH59.1
$2N6897: D58.2(A) SWCH58.1
$2N6903: LED55.4(DI) LED56.1(DO)
$2N6919: LED39.4(DI) LED53.1(DO)
$2N6925: D53.2(A) SWCH53.1
$2N6927: LED8.4(DI) LED9.1(DO)
$2N6931: LED6.4(DI) LED7.1(DO)
$2N6937: D9.2(A) SWCH9.1
$2N6945: D7.2(A) SWCH7.1
$2N6951: LED7.4(DI) LED8.1(DO)
$2N6961: D8.2(A) SWCH8.1
$2N6967: LED64.4(DI) LED65.1(DO)
$2N6975: D65.2(A) SWCH65.1
$2N6985: LED63.4(DI) LED64.1(DO)
$2N6989: D64.2(A) SWCH64.1
$2N6997: D39.2(A) SWCH39.1
$2N7009: D37.2(A) SWCH37.1
$2N7011: LED38.4(DI) LED39.1(DO)
$2N7017: LED25.4(DI) LED26.1(DO)
$2N7027: D26.2(A) SWCH26.1
$2N7039: LED12.4(DI) LED13.1(DO)
$2N7043: D13.2(A) SWCH13.1
$2N7047: D12.2(A) SWCH12.1
$2N7053: LED37.4(DI) LED38.1(DO)
$2N7061: D38.2(A) SWCH38.1
$2N7067: LED24.4(DI) LED25.1(DO)
$2N7073: D25.2(A) SWCH25.1
$2N7077: LED11.4(DI) LED12.1(DO)
$2N7091: LED62.4(DI) LED63.1(DO)
$2N7097: D63.2(A) SWCH63.1
$2N7105: D62.2(A) SWCH62.1
$2N7113: LED36.4(DI) LED37.1(DO)
$2N7121: D36.2(A) SWCH36.1
$2N7129: LED35.4(DI) LED36.1(DO)
$2N7147: D11.2(A) SWCH11.1
$2N7151: LED10.4(DI) LED11.1(DO)
$2N7157: LED22.4(DI) LED23.1(DO)
$2N7165: D23.2(A) SWCH23.1
$2N7167: LED9.4(DI) LED10.1(DO)
$2N7177: LED23.4(DI) LED24.1(DO)
$2N7189: D24.2(A) SWCH24.1
$2N7191: D10.2(A) SWCH10.1
$2N7201: D34.2(A) SWCH34.1
$2N7205: D33.2(A) SWCH33.1
$2N7211: D31.2(A) SWCH31.1
$2N7215: D32.2(A) SWCH32.1
$2N7227: D29.2(A) SWCH29.1
$2N7229: D30.2(A) SWCH30.1
$2N7235: D17.2(A) SWCH17.1
$2N7241: LED16.4(DI) LED17.1(DO)
$2N7247: LED17.4(DI) LED18.1(DO)
$2N7251: D16.2(A) SWCH16.1
$2N7255: LED15.4(DI) LED16.1(DO)
$2N7265: LED19.4(DI) LED20.1(DO)
$2N7275: LED18.4(DI) LED19.1(DO)
$2N7281: LED20.4(DI) LED21.1(DO)
$2N7295: D21.2(A) SWCH21.1
$2N7305: D20.2(A) SWCH20.1
$2N7309: D19.2(A) SWCH19.1
$2N7311: D18.2(A) SWCH18.1
$2N7315: D3.2(A) SWCH3.1
$2N7317: D2.2(A) SWCH2.1
$2N7319: LED1.4(DI) LED2.1(DO)
$2N7337: D15.2(A) SWCH15.1
$2N7341: LED14.4(DI) LED15.1(DO)
$2N7351: D28.2(A) SWCH28.1
$2N7357: D27.2(A) SWCH27.1
$2N7371: LED2.4(DI) LED3.1(DO)
$2N7377: D1.2(A) SWCH1.1
$2N7385: LED3.4(DI) LED4.1(DO)
$2N7391: LED4.4(DI) LED5.1(DO)
$2N7399: D4.2(A) SWCH4.1
$2N7413: D6.2(A) SWCH6.1
$2N7415: D5.2(A) SWCH5.1
$2N7419: LED5.4(DI) LED6.1(DO)
$2N7429: D22.2(A) SWCH22.1
$2N7433: D14.2(A) SWCH14.1
$2N7435: LED21.4(DI) LED22.1(DO)
$2N7443: LED26.4(DI) LED27.1(DO)
$2N9386: LED65.4(DI) LED66.1(DO)
$2N9395: LED76.4(DI) LED77.1(DO)
$2N9405: D77.2(A) SWCH77.1
$2N9409: LED77.4(DI) LED78.1(DO)
$2N9421: D78.2(A) SWCH78.1
$2N9423: D75.2(A) SWCH75.1
$2N9429: LED75.4(DI) LED76.1(DO)
$2N9437: D76.2(A) SWCH76.1
$2N9447: LED73.4(DI) LED74.1(DO)
$2N9453: LED74.4(DI) LED75.1(DO)
$2N9457: D74.2(A) SWCH74.1
$2N9461: D73.2(A) SWCH73.1
$2N9465: LED72.4(DI) LED73.1(DO)
$2N9475: LED69.4(DI) LED70.1(DO)
$2N9479: D69.2(A) SWCH69.1
$2N9483: LED68.4(DI) LED69.1(DO)
$2N9487: D72.2(A) SWCH72.1
$2N9497: LED71.4(DI) LED72.1(DO)
$2N9507: LED70.4(DI) LED71.1(DO)
$2N9515: D71.2(A) SWCH71.1
$2N9527: D70.2(A) SWCH70.1
$2N9533: LED67.4(DI) LED68.1(DO)
$2N9537: D68.2(A) SWCH68.1
$2N9555: D67.2(A) SWCH67.1
$2N9557: LED66.4(DI) LED67.1(DO)
$2N9565: D66.2(A) SWCH66.1
$2N9634: LED78.4(DI) Q2.3(C)
$2N83028: LED13.4(DI) LED14.1(DO)
$2N93358: Q2.1(B) R35.2
$3N15194: R32.1 U26.1(A)
$5N345: LED79.1(R-) LED79.3(B-) LED79.4(G-) R28.2
$5N443: R28.1 U19.7(CHRG#)
$5N587: R29.2 U19.2(PROG)
$5N1128: R30.1 U21.2(VM)
$5N1318: BGND1.1 Q1.2(S1) Q1.3(S1)
$5N1337: Q1.4(G1) U21.1(OD)
$5N1343: Q1.5(G2) U21.3(OC)
$5N1388: C9.2 R31.1 U21.5(VCC)
$5N1394: C9.1 U21.6(GND)
$5N2149: BVCC1.1 C10.2 D82.2(A) R31.2 U19.5(BAT)
$5N4044: C8.2 D87.1(K) LED79.2(COM+) U19.4(VCC) U19.8(CE)

Not connected (* = marked no-connect by the designer): LED1 1(DO)*; Q1 1(D12)* 8(D12)*; SW6 3*; U19 6(STDBY#)*; U21 4(TD)*; U27 27(IO0)* 28(IO35) 29(IO36) 30(IO37) 31(IO38) 32(IO39) 33(IO40) 34(IO41) 35(IO42) 36(RXD0)* 37(TXD0)* 38(IO2) 39(IO1); USB1 3(SBU2)* 4(CC1)* 9(SBU1)* 10(CC2)*

## Notes on the sheets
sheet 4
- OFF
- BLE
- USB
